# EAGLE design JVS (EAGLE 9.6.2)
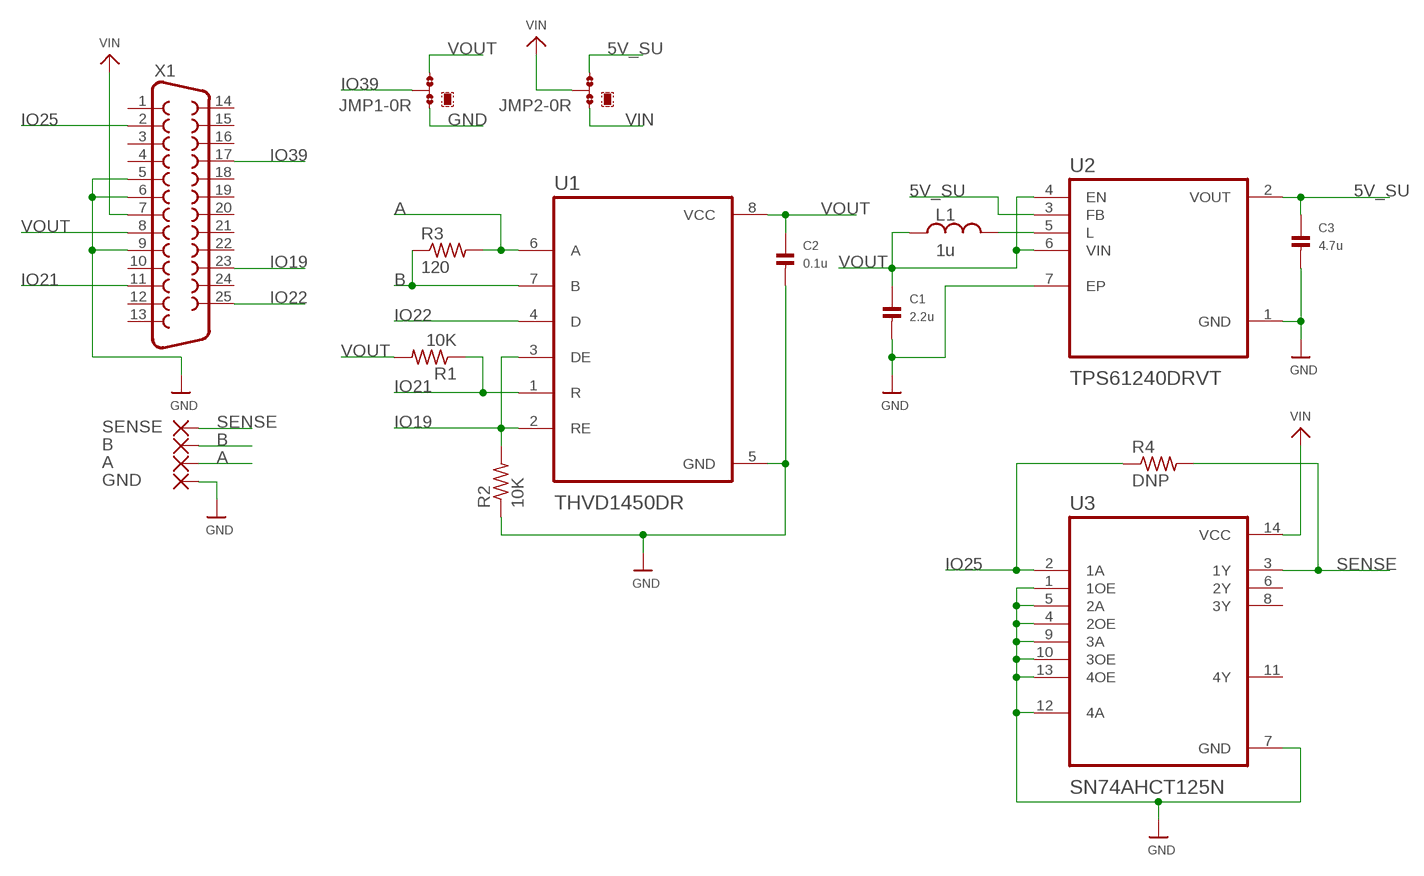
[diagram p0: schematic, sheet 1]

## Parts
A  SMD5  [SMD2,54-5,08]
B  SMD5  [SMD2,54-5,08]
C1  2.2u  CAP_CERAMIC1206  [1206]
C2  0.1u  CAP_CERAMIC1206  [1206]
C3  4.7u  CAP_CERAMIC1206  [1206]
GND  SMD5  [SMD2,54-5,08]
JMP1  0R-JUMPA  [A0R-JMP]
JMP2  0R-JUMPA  [A0R-JMP]
L1  1u  L_CHIP-0805(2012-METRIC)  [INDC2009X120]
R1  10K  R-US_R1206  [R1206]
R2  10K  R-US_R1206  [R1206]
R3  120  R-US_R1206  [R1206]
R4  DNP  R-US_R1206  [R1206]
SENSE  SMD5  [SMD2,54-5,08]
U1  THVD1450DR  [SOIC127P599X175-8N]
U2  TPS61240DRVT  [SON65P200X200X80-7N]
U3  SN74AHCT125N  [DIP794W45P254L1969H508Q14]
X1  DB25_FEMALEH  [F25H]

## Nets
5V_SU: C3.1 JMP2.3 U2.2(VOUT) U2.3(FB)
A: A.1(P) R3.2 U1.6(A)
B: B.1(P) R3.1 U1.7(B)
GND: C1.2 C2.2 C3.2 GND.1(P) JMP1.1 R2.1 U1.5(GND) U2.1(GND) U2.7(EP) U3.1(1OE) U3.4(2OE) U3.5(2A) U3.7(GND) U3.9(3A) U3.10(3OE) U3.12(4A) U3.13(4OE) X1.5 X1.6 X1.9
IO19: R2.2 U1.2(RE) U1.3(DE) X1.23
IO21: R1.1 U1.1(R) X1.11
IO22: U1.4(D) X1.25
IO25: R4.1 U3.2(1A) X1.2
IO39: JMP1.2 X1.17
N$1: L1.2 U2.5(L)
SENSE: R4.2 SENSE.1(P) U3.3(1Y)
VIN: JMP2.1 JMP2.2 U3.14(VCC) X1.7
VOUT: C1.1 C2.1 JMP1.3 L1.1 R1.2 U1.8(VCC) U2.4(EN) U2.6(VIN) X1.8
Unconnected: U3.6(2Y) U3.8(3Y) U3.11(4Y) X1.1 X1.3 X1.4 X1.10 X1.12 X1.13 X1.14 X1.15 X1.16 X1.18 X1.19 X1.20 X1.21 X1.22 X1.24

## Library data of the parts
A B GND SENSE = wirepad:SMD5: SMD PAD
C1-C3 = microbuilder:CAP_CERAMIC: Ceramic Capacitors 0402 - 0402 Surface Mount Capacitors 16pF 50V 5% [Digikey: 445-4899-2-ND] 18pF 50V 5% [Digikey: 490-1281-2-ND] 22pF 50V 5% [Digikey: 490-1283-2-ND] 68pF 50V 5% [Digikey: 490-1289-2-ND] 0.1uF 10V 10% [Digikey: 490-1318-2-ND] 1.0uF 6.3V 10% [Digikey: 490-1320-2-ND] 0603 - 0603 Surface Mount Capacitors 16 pF 50V 5% [Digikey: 445-5051-2-ND] 22 pF 50V [Digikey: PCC220ACVTR-ND] 33 pF 50V 5% [Digikey: 490-1415-1-ND] 56pF 50V 5% [Digikey: 490-1421-1-ND] 220pF 50V 5% [Digikey: 445-1285-1-ND] 680 pF 50V 2200 pF 50V 5% C0G [Digikey: 445-1297-1-ND] 5600 pF 100V 5% X7R [Digikey: 478-3711-1-ND] 0.1 µF 25V 10% [Digikey: PCC2277TR-ND] 0.22 µF 16V 10% X7R [Digikey: 445-1318-1-ND] 1.0 µF 25V 10% [Digikey: 445-5146-2-ND] 0603 - RF Specific 3pF 250V +/-0.1pF RF [Digikey: 712-1347-1-ND] 18 pF 250V 5% [Digikey: 478-3505-1-ND or 712-1322-1-ND] 56 pF 250V 5% C0G RF [Digikey: 490-4867-1-ND] 68 pF 250V RF [Digikey: 490-4868-1-ND] 0805 - 0805 Surface Mount Capacitors 220 pF 250V 2% RF Ceramic Capacitor [Digikey: 712-1398-1-ND] 1000 pF 50V 2% NP0 Ceramic Capacitor [Digikey: 478-3760-1-ND] 0.1 µF 25V 10% Ceramic Capacitor [Digikey: PCC1828TR-ND] 1.0 µF 16V 10% Ceramic Capacitor[Digikey: 490-1691-2-ND] 10.0 µF 10V 10% Ceramic Capacitor[Digikey: 709-1228-1-ND] 10.0 uF 16V 10% Ceramic Capacitor [Digikey: 478-5165-2-ND] 47 uF 6.3V 20% Ceramic Capacitor [Digikey: 587-1779-1-ND or 399-5506-1-ND] 1206 - 1206 Surface Mount Capacitors 47uF 10V 20% Ceramic Capacitor [Digikey: 490-5528-1-ND or 399-5508-1-ND or 445-6010-1-ND] 100uF 6.3V -20%, +80% Y5V Ceramic Capacitor (Digikey: 490-4512-1-ND, Mouser: 81-GRM31CF50J107ZE1L)
JMP1 JMP2 = jump-0r-smd:0R-JUMP: SMD 0R 0805 Jumper
L1 = Inductor:L: Inductor Fixed - Generic; CATEGORY: Inductor; SUB-CATEGORY: Fixed
R1-R4 = adafruit:R-US_: RESISTOR, American symbol
U1 = THVD1450DR:THVD1450DR: Check availability <https://pricing.snapeda.com/parts/THVD1450DR/Texas%20Instruments/view-part?ref=eda>; AVAILABILITY: In Stock; DESCRIPTION: 3.3-V to 5-V RS-485 transceiver with ±18-kV IEC ESD protection; MF: Texas Instruments; MP: THVD1450DR; PACKAGE: SOIC-8 Texas Instruments; PRICE: None; PURCHASE-URL: https://pricing.snapeda.com/search/part/THVD1450DR/?ref=eda
U2 = TPS61240DRVT:TPS61240DRVT; DESCRIPTION: 2.3-V to 5.5-V input range, 3.5-MHz fixed frequency 450-mA boost converter; DIGI-KEY_PART_NUMBER: 296-24519-2-ND; MF: Texas Instruments; MP: TPS61240DRVT; PACKAGE: WSON-6 Texas Instruments; PURCHASE-URL: https://pricing.snapeda.com/search/part/TPS61240DRVT/?ref=eda
U3 = SN74AHCT125N:SN74AHCT125N: None Check prices <https://pricing.snapeda.com/parts/SN74AHCT125N/Texas%20Instruments/view-part?ref=eda>; AVAILABILITY: In Stock; DESCRIPTION: Quadruple Bus Buffer Gates With 3-State Outputs 14-PDIP -40 to 125; MF: Texas Instruments; MP: SN74AHCT125N; PACKAGE: PDIP-14 Texas Instruments; PRICE: None; PURCHASE-URL: https://pricing.snapeda.com/search/part/SN74AHCT125N/?ref=eda
X1 = SparkFun-Retired:DB25_FEMALE: 25 Pin male connector. PCB edge mount for regular PCB thicknesses. This connector will connect directly to the back of a PC parallel port or through a normal DB25 extension cable (M/F). SKU: PRT-08287

## Board
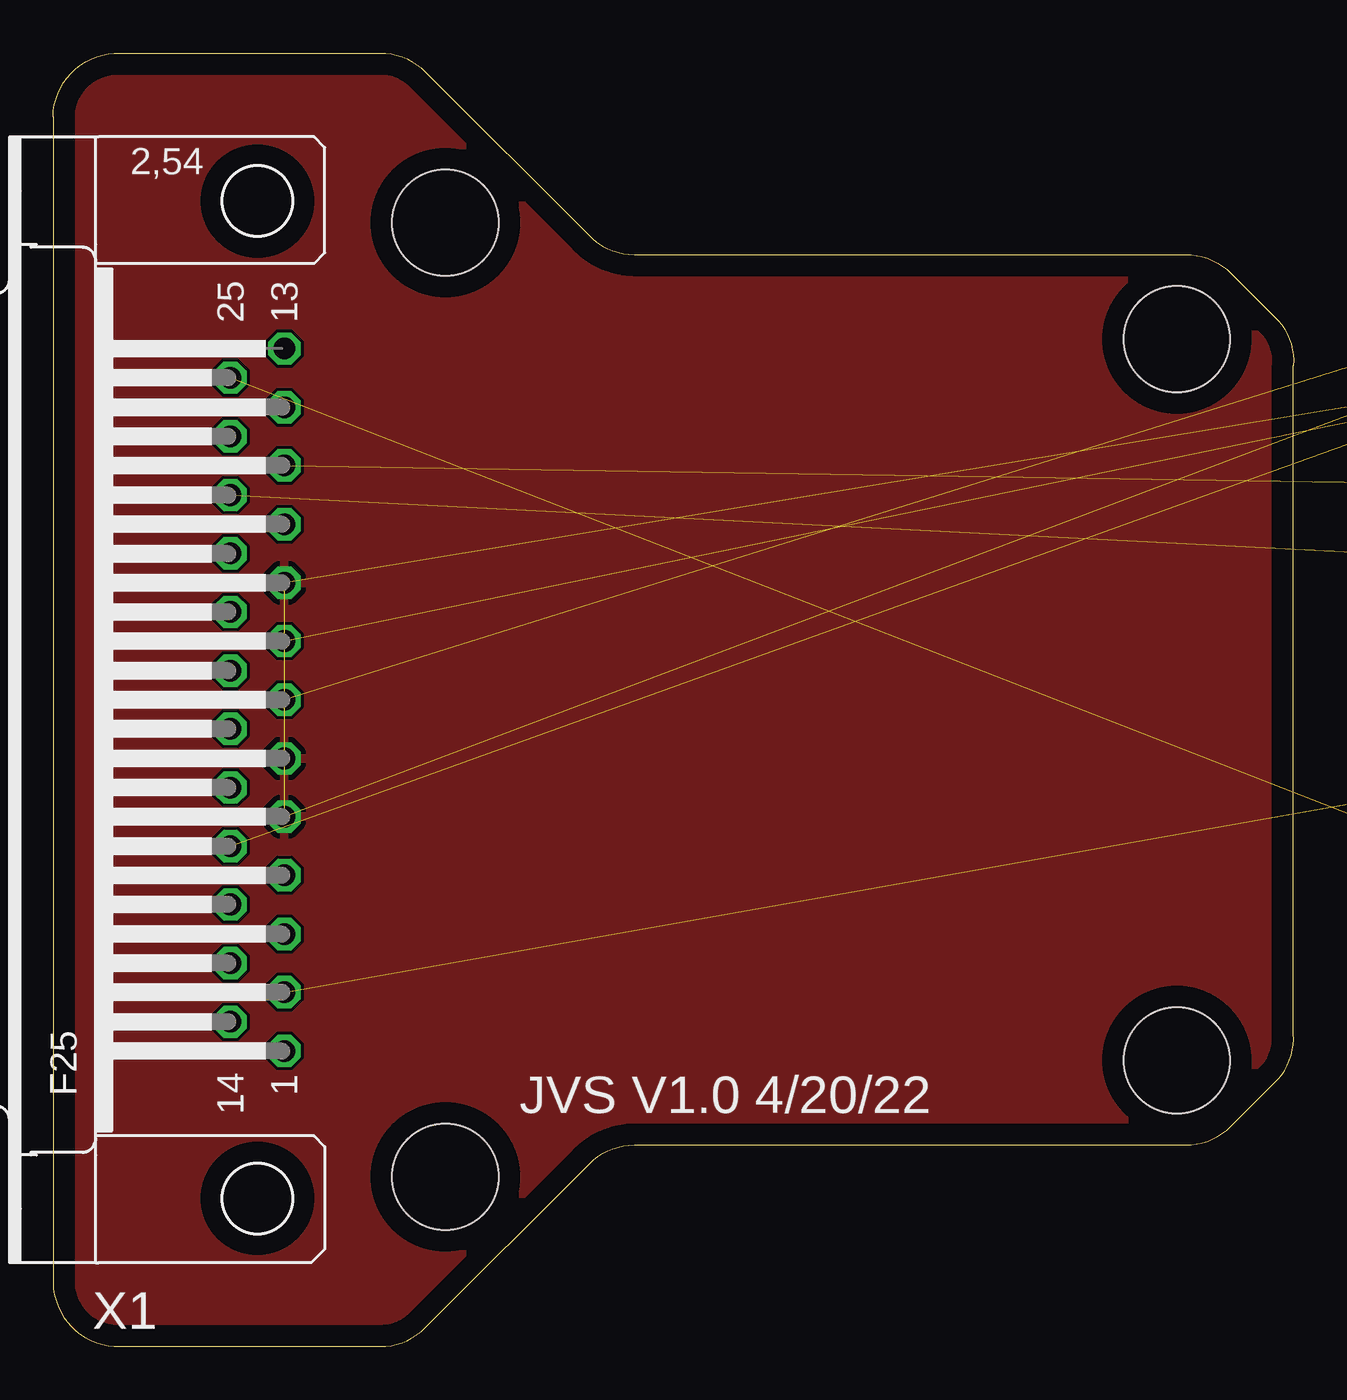
[diagram p1: board, top side]
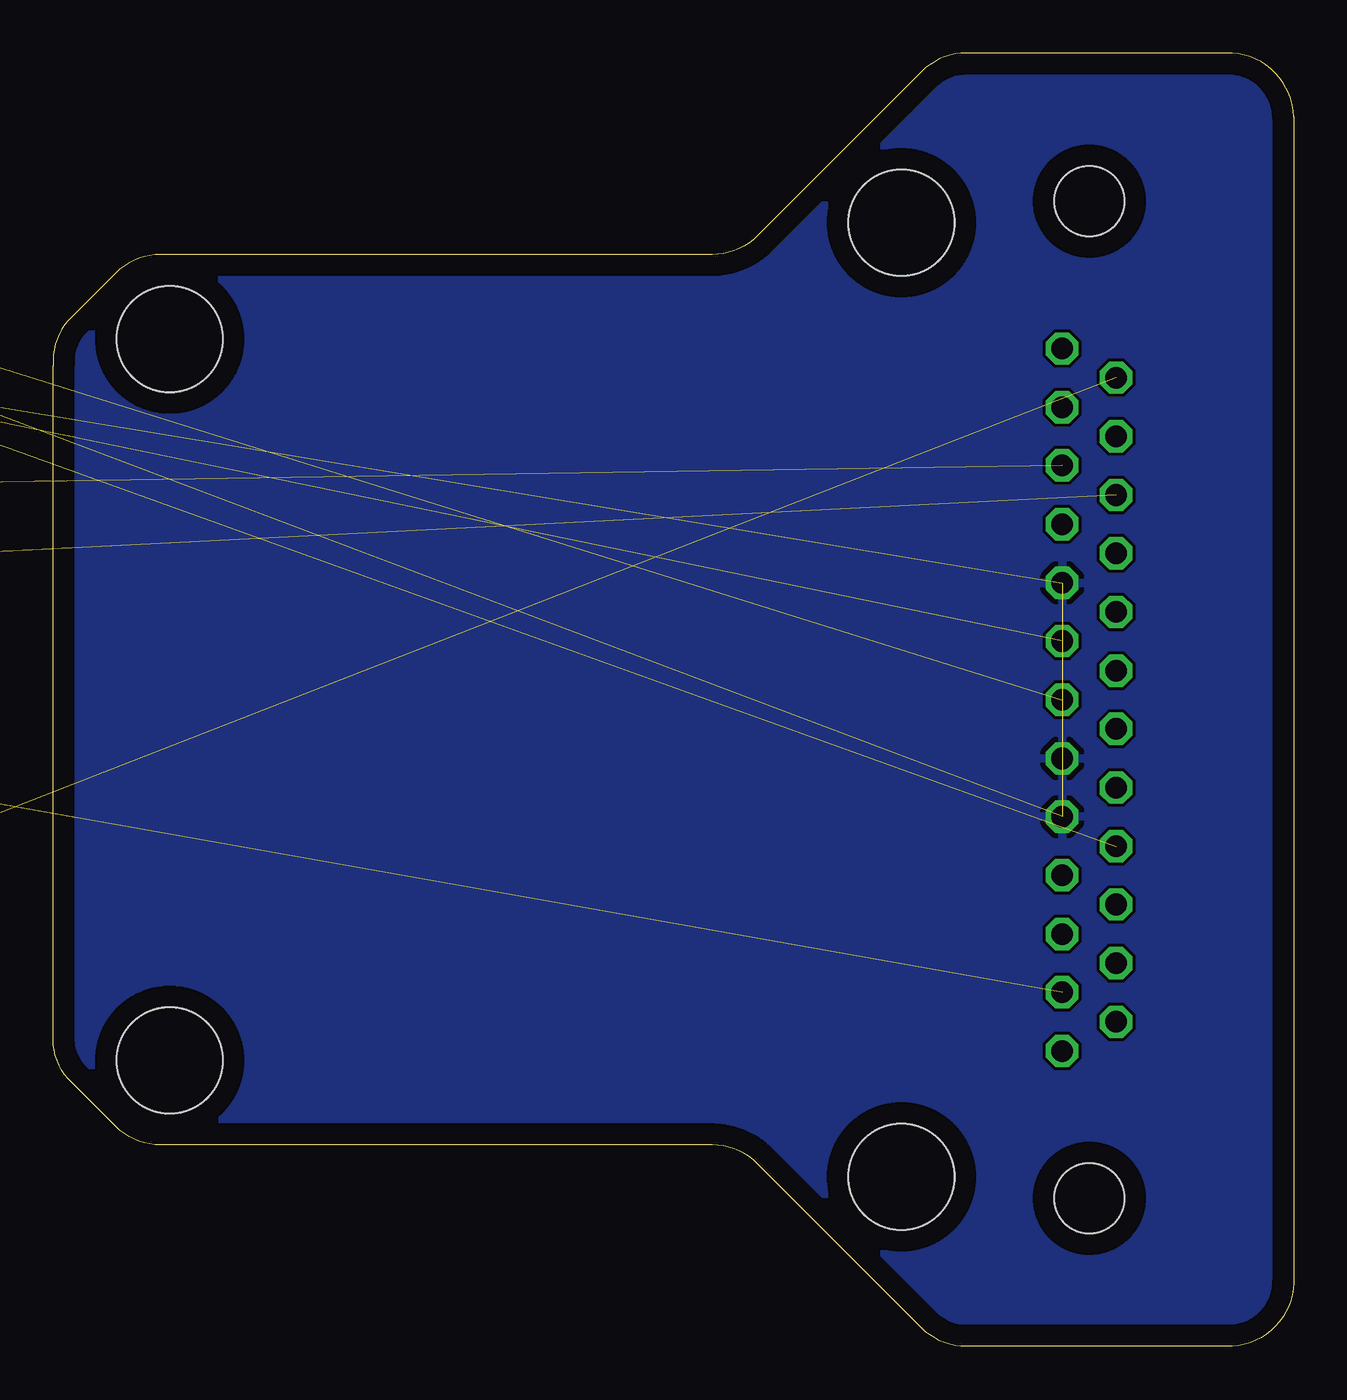
[diagram p2: board, bottom side, seen from below]

Size 58.51 x 61 mm. Coordinates in mm from the lower left corner, seen from the top.
Outline: 0,58 0,3 arc90 3.17,0 15.43,0 arc45 17.55,0.88 25.29,8.62 arc-45 27.41,9.5 53.43,9.5 arc45 55.55,10.38 57.79,12.62 arc45 58.5,14.74 58.5,46.26 arc45 57.79,48.38 55.55,50.62 arc45 53.43,51.5 27.41,51.5 arc-45 25.29,52.38 17.55,60.12 arc45 15.43,61 3.17,61 arc90 0,58
Copper layers (1*16): Top 0.035mm / dielectric 1.5mm / Bottom 0.035mm
Design rules "default": minimum track width 6mil, minimum drill 0.35mm, track to track 6mil, track to pad 6mil, pad to pad 6mil, via to via 6mil, smd to smd 6mil, copper to edge 40mil, drill to drill 6mil, minimum pad ring 10mil, minimum via ring 8mil, stop-mask expansion 4mil, vias tented up to drill 0.5mm, thermal gap 10mil
Holes 5 mm at 53,13.5 53,47.5 18.5,53 18.5,8

### Footprints (pad centres in the part's own frame; a part is rotated, then mirrored left to right if it is on the bottom)
SMD2,54-5,08 = smd 2.54 x 5.08: 1 0,0
1206 = smd 1.6 x 1.8: 1 -1.4,0; 2 1.4,0
A0R-JMP = smd 1.5 x 1.3: 1 0,1.7; 2 0,0; 3 0,-1.7
INDC2009X120 = smd 0.876 x 1.21: 1 -1.067,0; 2 1.067,0
R1206 = smd 1.6 x 1.803: 1 -1.422,0; 2 1.422,0
SOIC127P599X175-8N = smd 1.97 x 0.6: 1 -2.47,1.905; 2 -2.47,0.635; 3 -2.47,-0.635; 4 -2.47,-1.905; 5 2.47,-1.905; 6 2.47,-0.635; 7 2.47,0.635; 8 2.47,1.905
SON65P200X200X80-7N = smd 0.66 x 0.32: 1 -1.025,0.65; 2 -1.025,0; 3 -1.025,-0.65; 4 1.025,-0.65; 5 1.025,0; 6 1.025,0.65 | smd 1 x 1.6: 7 0,0
DIP794W45P254L1969H508Q14 = drill 0.74 pad 1.14 square: 1 -3.97,7.62 | drill 0.74 pad 1.14: 2 -3.97,5.08; 3 -3.97,2.54; 4 -3.97,0; 5 -3.97,-2.54; 6 -3.97,-5.08; 7 -3.97,-7.62; 8 3.97,-7.62; 9 3.97,-5.08; 10 3.97,-2.54; 11 3.97,0; 12 3.97,2.54; 13 3.97,5.08; 14 3.97,7.62
F25H = drill 1.016 octagon: 1 -16.561,-1.27; 2 -13.792,-1.27; 3 -11.049,-1.27; 4 -8.28,-1.27; 5 -5.512,-1.27; 6 -2.769,-1.27; 7 0,-1.27; 8 2.769,-1.27; 9 5.512,-1.27; 10 8.28,-1.27; 11 11.049,-1.27; 12 13.792,-1.27; 13 16.561,-1.27; 14 -15.189,1.27; 15 -12.421,1.27; 16 -9.652,1.27; 17 -6.909,1.27; 18 -4.14,1.27; 19 -1.372,1.27; 20 1.372,1.27; 21 4.14,1.27; 22 6.909,1.27; 23 9.652,1.27; 24 12.421,1.27; 25 15.189,1.27 | hole 3.302: -23.52,0; 23.52,0

### Placement (x,y rotation side)
A  92.5,45 270 top  (outside the outline)
B  92.5,39.5 270 top  (outside the outline)
C1  79,26 0 top  (outside the outline)
C2  79,23.5 0 top  (outside the outline)
C3  79,21 0 top  (outside the outline)
GND  92.5,49.5 270 top  (outside the outline)
JMP1  79,49 0 top  (outside the outline)
JMP2  75.5,49 0 top  (outside the outline)
L1  78.5,18 0 top  (outside the outline)
R1  79,40.5 0 top  (outside the outline)
R2  79,36.5 0 top  (outside the outline)
R3  79,32.5 0 top  (outside the outline)
R4  79,28.5 0 top  (outside the outline)
SENSE  92.5,33.5 270 top  (outside the outline)
U1  67.5,25.5 0 top  (outside the outline)
U2  66.5,19 0 top  (outside the outline)
U3  67,42 0 top  (outside the outline)
X1  9.64,30.5 90 top

### Tracks (layer width: path | path; a pad name or v marks a point on that pad's centre or on a via)
5V_SU  (3 unrouted)
A  (2 unrouted)
B  (2 unrouted)
GND  (19 unrouted)
  pour Top: 0,0 0,61 28.67,61 28.67,51.5 59.17,51.5 59.17,9.5 28.17,9.5 28.17,0
  pour Bottom: 0,0 0,61 28.67,61 28.67,51.5 59.17,51.5 59.17,9.5 28.17,9.5 28.17,0
IO19  (3 unrouted)
IO21  (2 unrouted)
IO22  (1 unrouted)
IO25  (2 unrouted)
IO39  (1 unrouted)
N$1  (1 unrouted)
SENSE  (2 unrouted)
VIN  (3 unrouted)
VOUT  (8 unrouted)

### Text on the board
tPlace: JVS V1.0 4/20/22